# Altium schematic sheet Main.SchDoc: Main
size A3; Date: 17/09/18; Author: Pablo Sánchez Bergasa; Revision: 2.A.1; SheetNumber: 1; SheetTotal: 4; DocumentName: Main
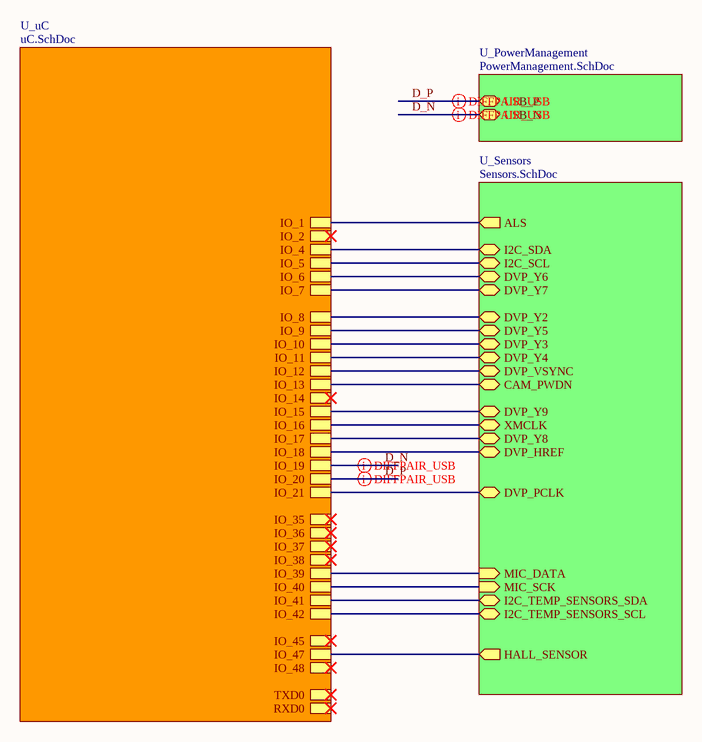
[diagram p0: Main.SchDoc]

## Sub-sheets
U_PowerManagement = PowerManagement.SchDoc: USB_P (bidir), USB_N (bidir)
U_Sensors = Sensors.SchDoc: MIC_SCK (in), MIC_DATA (in), I2C_SDA (bidir), I2C_SCL (bidir), ALS (out), I2C_TEMP_SENSORS_SDA (bidir), I2C_TEMP_SENSORS_SCL (bidir), HALL_SENSOR (out), DVP_VSYNC (bidir), DVP_HREF (bidir), DVP_Y2 (bidir), DVP_Y3 (bidir), DVP_Y7 (bidir), DVP_Y9 (bidir), XMCLK (bidir), DVP_PCLK (bidir), DVP_Y4 (bidir), DVP_Y6 (bidir), CAM_PWDN (bidir), DVP_Y8 (bidir), DVP_Y5 (bidir)
U_uC = uC.SchDoc: IO_4, IO_5, IO_35, IO_6, IO_7, IO_8, IO_9, IO_10, IO_11, IO_12, IO_13, IO_14, IO_15, IO_16, IO_17, IO_18, IO_19, IO_20, IO_21, IO_36, IO_37, IO_38, IO_1, IO_2, TXD0, RXD0, IO_39, IO_40, IO_41, IO_42, IO_47, IO_48, IO_45

## Nets
D_N: sheet U_uC/IO_19, sheet U_PowerManagement/USB_N
D_P: sheet U_uC/IO_20, sheet U_PowerManagement/USB_P
(unnamed): sheet U_uC/IO_4, sheet U_Sensors/I2C_SDA
(unnamed): sheet U_uC/IO_5, sheet U_Sensors/I2C_SCL
(unnamed): sheet U_uC/IO_6, sheet U_Sensors/DVP_Y6
(unnamed): sheet U_uC/IO_7, sheet U_Sensors/DVP_Y7
(unnamed): sheet U_uC/IO_8, sheet U_Sensors/DVP_Y2
(unnamed): sheet U_uC/IO_9, sheet U_Sensors/DVP_Y5
(unnamed): sheet U_uC/IO_10, sheet U_Sensors/DVP_Y3
(unnamed): sheet U_uC/IO_11, sheet U_Sensors/DVP_Y4
(unnamed): sheet U_uC/IO_12, sheet U_Sensors/DVP_VSYNC
(unnamed): sheet U_uC/IO_13, sheet U_Sensors/CAM_PWDN
(unnamed): sheet U_uC/IO_15, sheet U_Sensors/DVP_Y9
(unnamed): sheet U_uC/IO_16, sheet U_Sensors/XMCLK
(unnamed): sheet U_uC/IO_17, sheet U_Sensors/DVP_Y8
(unnamed): sheet U_uC/IO_18, sheet U_Sensors/DVP_HREF
(unnamed): sheet U_uC/IO_21, sheet U_Sensors/DVP_PCLK
(unnamed): sheet U_uC/IO_1, sheet U_Sensors/ALS
(unnamed): sheet U_uC/IO_39, sheet U_Sensors/MIC_DATA
(unnamed): sheet U_uC/IO_40, sheet U_Sensors/MIC_SCK
(unnamed): sheet U_uC/IO_41, sheet U_Sensors/I2C_TEMP_SENSORS_SDA
(unnamed): sheet U_uC/IO_42, sheet U_Sensors/I2C_TEMP_SENSORS_SCL
(unnamed): sheet U_uC/IO_47, sheet U_Sensors/HALL_SENSOR

## Layout directives
differential pair; differential pair class USB: D_N, D_P

## Notes on the sheet
- Title
- Size:
- Date:
- A3
- Author:
- Time:
- Revision:
- Sheet
- of
- File: